# EAGLE schematic LTC Whole System Schematic (EAGLE 6.5.0)
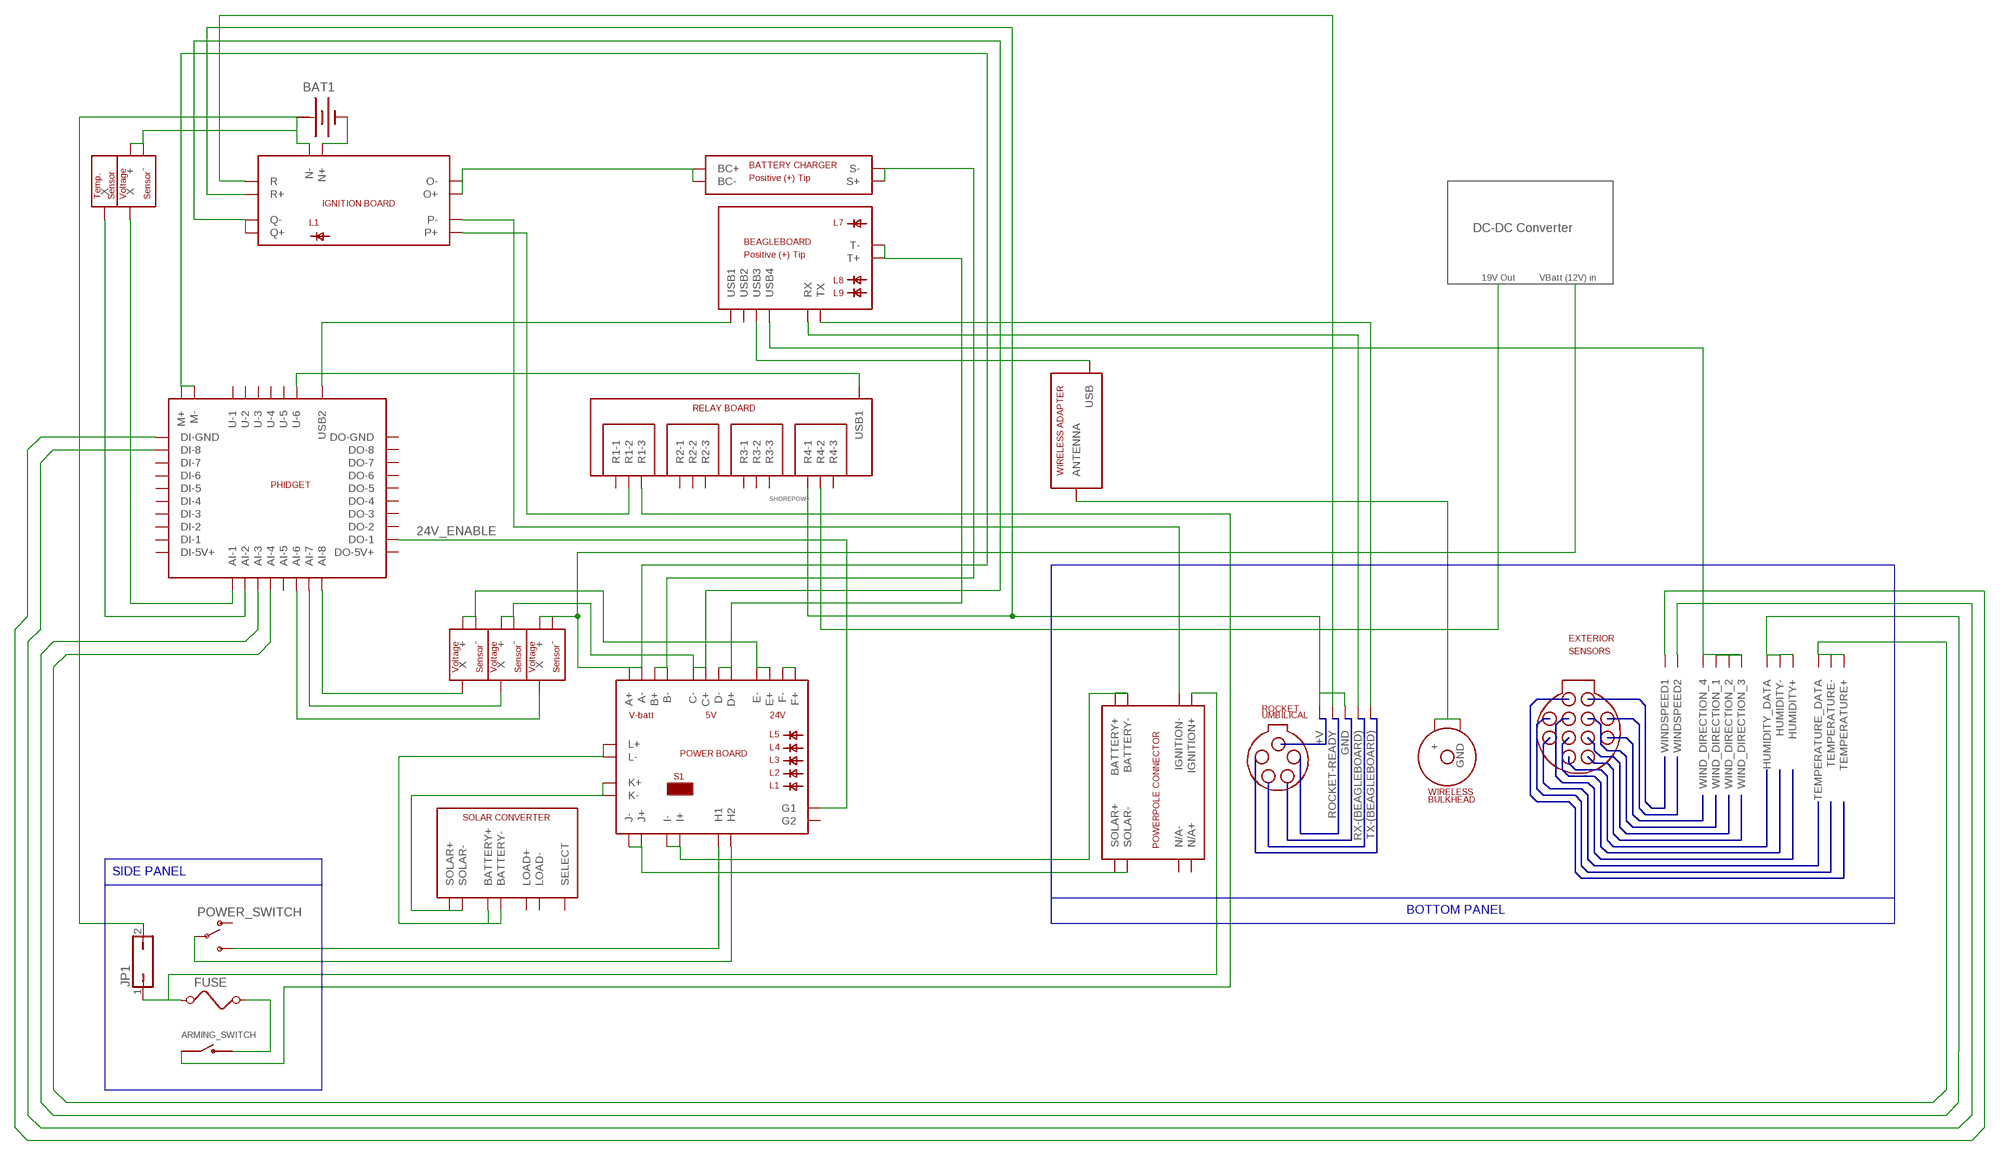
[diagram p0: schematic, sheet 1]

## Parts
ARMING_SWITCH  LAYOUT-SWITCH-SPST  [LAYOUT-PACKAGE]
BAT1  BATTERY  [BATTERY]
FUSE  FUSE  [FUSE]
JP1  JP1Q  [JP1]
POWER_SWITCH  SWITCH_SPDT  [KPS-1290]
U$1  LAYOUT-POWER-BOARD  [LAYOUT-PACKAGE]
U$2  LAYOUT-IGNITION-BOARD  [LAYOUT-PACKAGE]
U$3  LAYOUT-BATTERY-CHARGER  [LAYOUT-PACKAGE]
U$4  LAYOUT-BEAGLEBOARD  [LAYOUT-PACKAGE]
U$5  LAYOUT-PHIDGET  [LAYOUT-PACKAGE]
U$6  LAYOUT-RELAY-BOARD  [LAYOUT-PACKAGE]
U$7  LAYOUT-SOLAR-CONVERTER  [LAYOUT-PACKAGE]
U$8  LAYOUT-POWERPOLE  [LAYOUT-PACKAGE]
U$9  LAYOUT-SENSOR-VOLTAGE  [LAYOUT-PACKAGE]
U$10  LAYOUT-SENSOR-VOLTAGE  [LAYOUT-PACKAGE]
U$11  LAYOUT-SENSOR-VOLTAGE  [LAYOUT-PACKAGE]
U$12  LAYOUT-SENSOR-VOLTAGE  [LAYOUT-PACKAGE]
U$13  LAYOUT-SENSOR-TEMPERATURE  [LAYOUT-PACKAGE]
U$14  LAYOUT-UMBILICAL  [LAYOUT-PACKAGE]
U$15  LAYOUT-WIFI  [LAYOUT-PACKAGE]
U$16  LAYOUT-WIFI-BULKHEAD  [LAYOUT-PACKAGE]
U$17  LAYOUT-LEMO-12PIN  [LEMO-12]

## Nets
24V_ENABLE: U$1.P$23(G1) U$5.P$19(DO-1)
N$1: U$1.P$13(L+) U$1.P$14(L-) U$7.P$1(BATTERY+) U$7.P$2(BATTERY-)
N$2: U$1.P$15(K+) U$1.P$16(K-) U$7.P$6(SOLAR+) U$7.P$7(SOLAR-)
N$3: U$1.P$3(B+) U$1.P$4(B-) U$3.P$1(S+) U$3.P$2(S-)
N$4: U$1.P$7(D-) U$1.P$8(D+) U$4.P$1(T+) U$4.P$2(T-)
N$5: U$5.P$8(AI-8) U$10.P$3(X)
N$6: U$6.P$14(R4-2)
N$7: U$1.P$5(C-) U$1.P$6(C+) U$2.P$7(Q+) U$2.P$8(Q-) U$12.P$1(+) U$12.P$2(-)
N$8: U$5.P$7(AI-7) U$12.P$3(X)
N$9: U$1.P$19(I-) U$1.P$20(I+) U$8.P$1(BATTERY+) U$8.P$2(BATTERY-)
N$10: U$1.P$1(A+) U$1.P$2(A-) U$5.P$29(M+) U$5.P$30(M-) U$11.P$1(+) U$11.P$2(-)
N$11: U$1.P$9(E-) U$1.P$10(E+) U$10.P$1(+) U$10.P$2(-)
N$12: U$4.P$3(USB1) U$5.P$37(USB2)
N$13: U$5.P$36(U-6) U$6.P$12(USB1)
N$14: U$2.P$5(P+) U$6.P$23(R1-2)
N$15: U$2.P$6(P-) U$8.P$4(IGNITION-)
N$16: U$4.P$6(USB4) U$17.P3(WIND_DIRECTION_3) U$17.P4(WIND_DIRECTION_4) U$17.P10(WIND_DIRECTION_2) U$17.P11(WIND_DIRECTION_1)
N$17: U$1.P$17(J-) U$1.P$18(J+) U$8.P$7(SOLAR+) U$8.P$8(SOLAR-)
N$18: U$5.P$6(AI-6) U$11.P$3(X)
N$19: U$2.P$3(O+) U$2.P$4(O-) U$3.P$3(BC+) U$3.P$4(BC-)
N$20: U$5.P$1(AI-1) U$9.P$3(X)
N$21: U$5.P$2(AI-2) U$13.P$1(X)
N$22: U$1.P$11(F-) U$1.P$12(F+)
N$23: BAT1.- U$2.P$1(N+)
N$24: U$4.P$8(TX) U$14.P$5(TX-(BEAGLEBOARD))
N$25: U$2.P$9(R) U$14.P$3(ROCKET-READY)
N$26: U$4.P$7(RX) U$14.P$4(RX-(BEAGLEBOARD))
N$27: U$5.P$3(AI-3)
N$28: U$5.P$4(AI-4) U$17.P1(TEMPERATURE+) U$17.P7(TEMPERATURE_DATA) U$17.P8(TEMPERATURE-)
N$29: U$17.P2(HUMIDITY_DATA) U$17.P9(HUMIDITY-) U$17.P12(HUMIDITY+)
N$30: BAT1.+ JP1.2 U$2.P$2(N-) U$9.P$1(+) U$9.P$2(-)
N$31: U$4.P$5(USB3) U$15.P$2(USB)
N$32: FUSE.1 JP1.1 U$8.P$3(IGNITION+)
N$33: U$15.P$1(ANTENNA) U$16.P$1(+) U$16.P$2(GND)
N$34: POWER_SWITCH.S U$1.P$21(H1)
N$35: POWER_SWITCH.P U$1.P$22(H2)
N$36: ARMING_SWITCH.P$2 FUSE.2
N$37: ARMING_SWITCH.P$1 U$6.P$22(R1-3)
N$39: U$5.P$18(DI-GND) U$17.P6(WINDSPEED1)
N$40: U$5.P$17(DI-8) U$17.P5(WINDSPEED2)
SHOREPOW+: U$2.P$10(R+) U$6.P$15(R4-1) U$14.P$1(+V) U$14.P$2(GND)
Unconnected: POWER_SWITCH.O U$1.P$24(G2) U$4.P$4(USB2) U$5.P$5(AI-5) U$5.P$9(DI-1) U$5.P$10(DI-2) U$5.P$11(DI-3) U$5.P$12(DI-4) U$5.P$13(DI-5) U$5.P$14(DI-5V+) U$5.P$15(DI-6) U$5.P$16(DI-7) U$5.P$20(DO-2) U$5.P$21(DO-3) U$5.P$22(DO-4) U$5.P$23(DO-5) U$5.P$24(DO-5V+) U$5.P$25(DO-6) U$5.P$26(DO-7) U$5.P$27(DO-8) U$5.P$28(DO-GND) U$5.P$31(U-1) U$5.P$32(U-2) U$5.P$33(U-3) U$5.P$34(U-4) U$5.P$35(U-5) U$6.P$13(R4-3) U$6.P$16(R3-3) U$6.P$17(R3-2) U$6.P$18(R3-1) U$6.P$19(R2-3) U$6.P$20(R2-2) U$6.P$21(R2-1) U$6.P$24(R1-1) U$7.P$3(LOAD+) U$7.P$4(LOAD-) U$7.P$5(SELECT) U$8.P$5(N/A+) U$8.P$6(N/A-)

## Buses
B$1
B$2

## Notes on the sheet
- DC-DC Converter
- 19V Out | VBatt (12V) in
- SIDE PANEL
- BOTTOM PANEL

## Power pins joined to a net without a drawn wire
+: BAT1.+@1(+)

## Library data of the parts
ARMING_SWITCH = launch-tower:LAYOUT-SWITCH-SPST
BAT1 = special:BATTERY: BATTERY
FUSE = special:FUSE: FUSE 5 x 20 mm
JP1 = jumper:JP1Q: JUMPER
POWER_SWITCH = SparkFun-Electromechanical:SWITCH_SPDT: Side-actuated SPDT slide switch, as used on the Arduino Pro
U$1 = launch-tower:LAYOUT-POWER-BOARD
U$2 = launch-tower:LAYOUT-IGNITION-BOARD
U$3 = launch-tower:LAYOUT-BATTERY-CHARGER
U$4 = launch-tower:LAYOUT-BEAGLEBOARD
U$5 = launch-tower:LAYOUT-PHIDGET
U$6 = launch-tower:LAYOUT-RELAY-BOARD
U$7 = launch-tower:LAYOUT-SOLAR-CONVERTER
U$8 = launch-tower:LAYOUT-POWERPOLE
U$9-U$12 = launch-tower:LAYOUT-SENSOR-VOLTAGE
U$13 = launch-tower:LAYOUT-SENSOR-TEMPERATURE
U$14 = launch-tower:LAYOUT-UMBILICAL
U$15 = launch-tower:LAYOUT-WIFI
U$16 = launch-tower:LAYOUT-WIFI-BULKHEAD
U$17 = launch-tower:LAYOUT-LEMO-12PIN